# Altium schematic sheet SendClient_Sheet.schdoc
size 233 x 232 mm
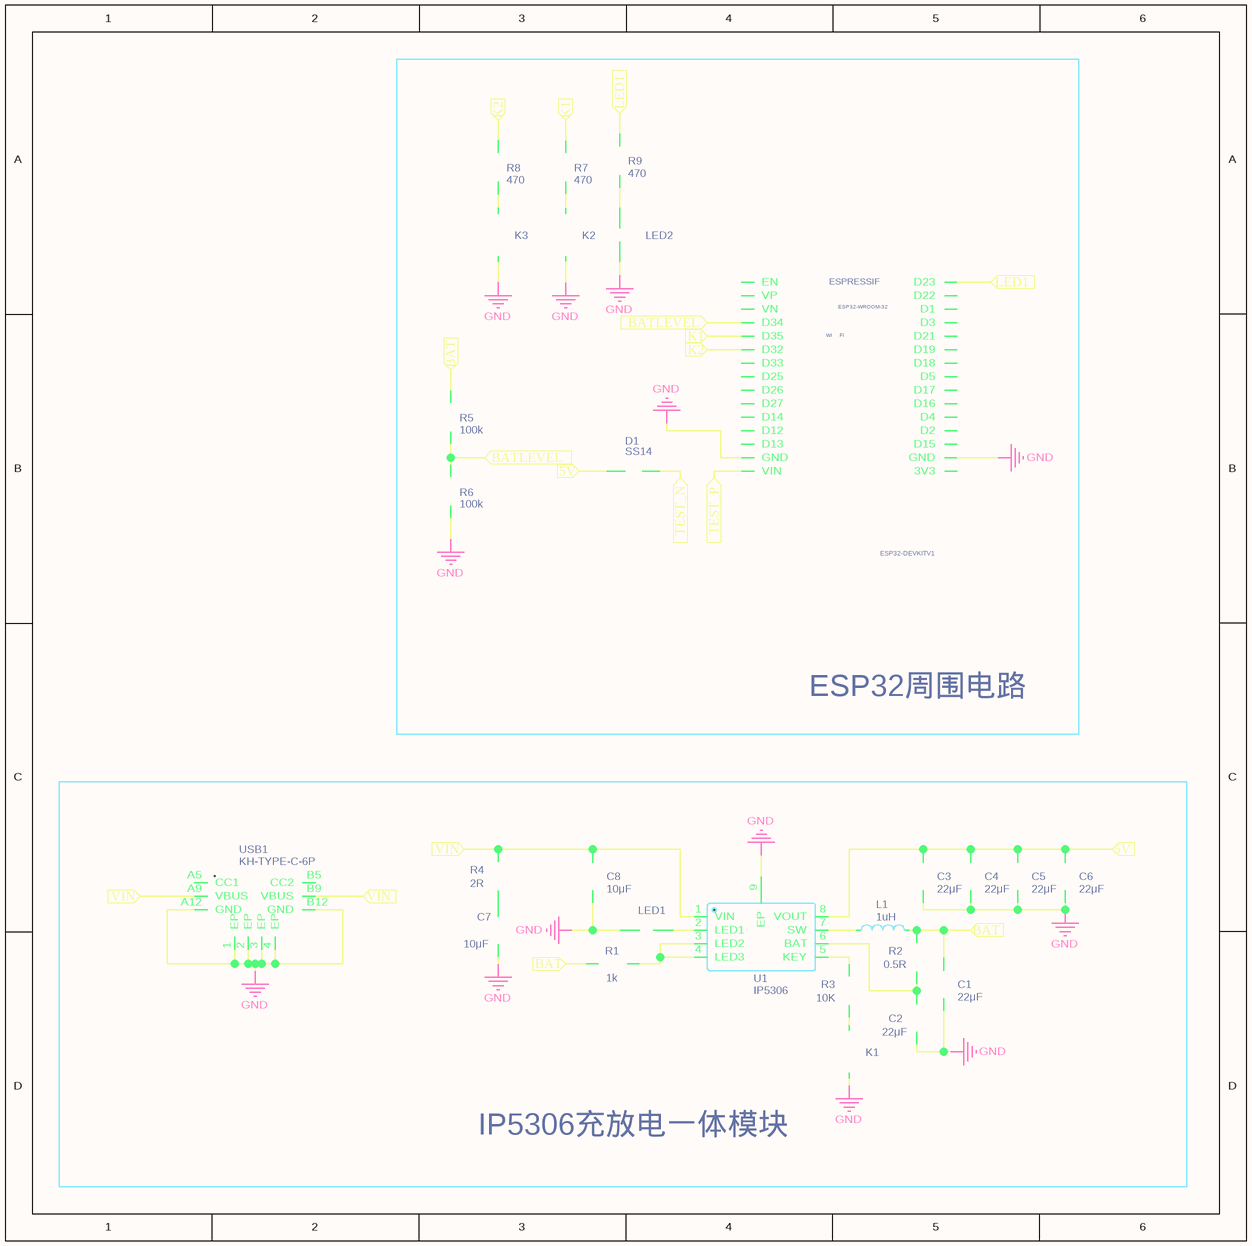
[diagram p0: SendClient_Sheet.schdoc]

## Parts
BOARD1  ESP32DEVKITV1  [ESP32-DEVKITV1]  (value not drawn)
C1  22μF  [C0603]
C2  22μF  [C0603]
C3  22μF  [C0603]
C4  22μF  [C0603]
C5  22μF  [C0603]
C6  22μF  [C0603]
C7  10μF  [C0603]
C8  10μF  [C0603]
D1  SS14  [SMA_L4.4-W2.8-LS5.4-RD]
K1  BUTTON_FLASH  [SMT_SW_PTS_820]  (value not drawn)
K2  BUTTON_FLASH  [SMT_SW_PTS_820]  (value not drawn)
K3  BUTTON_FLASH  [SMT_SW_PTS_820]  (value not drawn)
L1  1uH  [IND-SMD_L7.1-W6.6]
LED1  LED-0603_R  [LED0603_RED]  (value not drawn)
LED2  LED-0603_R  [LED0603_RED]  (value not drawn)
R1  1k  [R0603]
R2  0.5R  [R0603]
R3  10K  [R0603]
R4  2R  [R0603]
R5  100k  [R0603]
R6  100k  [R0603]
R7  470  [R0603]
R8  470  [R0603]
R9  470  [R0603]
U1  IP5306  [ESOP-8_L4.9-W3.9-P1.27-LS6.0-BL-EP]
USB1  KH-TYPE-C-6P  [TYPE-C-SMD_TYPE-C-31-M-16]

## Blocks framed on the sheet
ESP32周围电路: BOARD1 D1 K2 K3 LED2 R5-R9
IP5306充放电一体模块: C1-C8 K1 L1 LED1 R1-R4 U1 USB1

## Ports
5V (in), BAT (in), BATLEVEL (in), K1 (in), K2 (in), LED1 (in), TEST_N (in), TEST_P (in), VIN (in)

## Nets
GND: BOARD1.GND BOARD1.GND@1(GND) C1.1 C2.1 C3.1 C4.1 C5.1 C6.1 C7.1 C8.1 K1.2 K2.2 K3.2 LED1.2 LED2.2 R6.2 U1.9(EP) USB1.1(EP) USB1.2(EP) USB1.3(EP) USB1.4(EP) USB1.A12(GND) USB1.B12(GND)
5V: C3.2 C4.2 C5.2 C6.2 D1.2(A) U1.8(VOUT) ; port 5V
BAT: C1.2 L1.2 R1.2 R2.1 R5.1 ; port BAT
BATLEVEL: BOARD1.D34 R5.2 R6.1 ; port BATLEVEL
K1: BOARD1.D35 R7.2 ; port K1
K2: BOARD1.D32 R8.2 ; port K2
LED1: BOARD1.D23 R9.2 ; port LED1
TEST_N: D1.1(K) ; port TEST_N
TEST_P: BOARD1.VIN ; port TEST_P
VIN: C8.2 R4.1 U1.1(VIN) USB1.A9(VBUS) USB1.B9(VBUS) ; port VIN
NetC2_2: C2.2 R2.2 U1.6(BAT)
NetC7_2: C7.2 R4.2
NetK1_1: K1.1 R3.2
NetK2_1: K2.1 R7.1
NetK3_1: K3.1 R8.1
NetL1_1: L1.1 U1.7(SW)
NetLED1_1: LED1.1 U1.2(LED1)
NetLED2_1: LED2.1 R9.1
NetR1_1: R1.1 U1.3(LED2) U1.4(LED3)
NetR3_1: R3.1 U1.5(KEY)

Not connected (* = marked no-connect by the designer): BOARD1 3V3 D1 D2 D3 D4 D5 D12 D13 D14 D15 D16 D17 D18 D19 D21 D22 D25 D26 D27 D33 EN VN VP; USB1 A5(CC1) B5(CC2)

## Notes on the sheet
- (in symbol ESP32DEVKITV1) ESPRESSIF; ESP32-WROOM-32; WI; FI; ESP32-DEVKITV1

## Library data of the parts
BOARD1 = ESP32DEVKITV1: Contributor: radio; Package Display: No; spicePre: B; spiceSymbolName: ESP32DEVKITV1
C1-C6 = 22μF: BOM_Manufacturer: Walsin Tech Corp; BOM_Manufacturer Part: 0603B101K500CT; nameAlias: Capacitance; Contributor: LCSC; BOM_Supplier: LCSC; BOM_Supplier Part: C338150; BOM_JLCPCB Part Class: Extended Part; spicePre: C; spiceSymbolName: 0603B101K500CT
C7 C8 = 10μF: BOM_Manufacturer: Walsin Tech Corp; BOM_Manufacturer Part: 0603B101K500CT; nameAlias: Capacitance; Contributor: LCSC; BOM_Supplier: LCSC; BOM_Supplier Part: C338150; BOM_JLCPCB Part Class: Extended Part; spicePre: C; spiceSymbolName: 0603B101K500CT
D1 = SS14: BOM_Manufacturer: MDD; BOM_Supplier: LCSC; BOM_Manufacturer Part: SS14; BOM_Supplier Part: C2480; BOM_JLCPCB Part Class: Basic Part; spicePre: D; spiceSymbolName: SS14
K1-K3 = BUTTON_FLASH: Contributor: dingding1; spicePre: S; spiceSymbolName: SMT_SW_PTS_820
L1 = 1uH: BOM_Manufacturer: PROD(谱罗德); BOM_Manufacturer Part: PSPMAA0603-1R0M-ANF; nameAlias: Inductance; Contributor: LCSC; BOM_Supplier: LCSC; BOM_Supplier Part: C436543; BOM_JLCPCB Part Class: Extended Part; spicePre: L; spiceSymbolName: PSPMAA0603-1R0M-ANF
LED1 LED2 = LED-0603_R: BOM_Manufacturer: EVERLIGHT(台湾亿光); BOM_Manufacturer Part: 19-217/R6C-AL1M2VY/3T; Contributor: LCEDA_01; BOM_Supplier Part: C72044; BOM_Supplier: LCSC; spicePre: L; spiceSymbolName: LED-0603_R
R1 = 1k: BOM_Manufacturer: YAGEO; BOM_Manufacturer Part: RC0603JR-079K1L; nameAlias: Resistance (Ohms); BOM_Supplier: LCSC; BOM_Supplier Part: C137602; BOM_JLCPCB Part Class: Extended Part; spicePre: R; spiceSymbolName: RC0603JR-079K1L
R2 = 0.5R: BOM_Manufacturer: YAGEO; BOM_Manufacturer Part: RC0603JR-079K1L; nameAlias: Resistance (Ohms); BOM_Supplier: LCSC; BOM_Supplier Part: C137602; BOM_JLCPCB Part Class: Extended Part; spicePre: R; spiceSymbolName: RC0603JR-079K1L
R3 = 10K: BOM_Manufacturer: YAGEO; BOM_Manufacturer Part: RC0603JR-079K1L; nameAlias: Resistance (Ohms); BOM_Supplier: LCSC; BOM_Supplier Part: C137602; BOM_JLCPCB Part Class: Extended Part; spicePre: R; spiceSymbolName: RC0603JR-079K1L
R4 = 2R: BOM_Manufacturer: YAGEO; BOM_Manufacturer Part: RC0603JR-079K1L; nameAlias: Resistance (Ohms); BOM_Supplier: LCSC; BOM_Supplier Part: C137602; BOM_JLCPCB Part Class: Extended Part; spicePre: R; spiceSymbolName: RC0603JR-079K1L
R5 R6 = 100k: BOM_Manufacturer: YAGEO; BOM_Manufacturer Part: RC0603JR-079K1L; nameAlias: Resistance (Ohms); BOM_Supplier: LCSC; BOM_Supplier Part: C137602; BOM_JLCPCB Part Class: Extended Part; spicePre: R; spiceSymbolName: RC0603JR-079K1L
R7-R9 = 470: BOM_Manufacturer: YAGEO; BOM_Manufacturer Part: RC0603JR-079K1L; nameAlias: Resistance (Ohms); BOM_Supplier: LCSC; BOM_Supplier Part: C137602; BOM_JLCPCB Part Class: Extended Part; spicePre: R; spiceSymbolName: RC0603JR-079K1L
U1 = IP5306: BOM_Manufacturer: INJOINIC; Contributor: LCSC; BOM_Supplier: LCSC; BOM_Supplier Part: C181692; BOM_Manufacturer Part: IP5306; BOM_JLCPCB Part Class: Extended Part; spicePre: U; spiceSymbolName: IP5306
USB1 = KH-TYPE-C-6P: BOM_Manufacturer: Shenzhen Kinghelm Elec; Contributor: LCSC; BOM_Supplier: LCSC; BOM_Supplier Part: C709355; BOM_Manufacturer Part: KH-TYPE-C-6P; BOM_JLCPCB Part Class: Extended Part; spicePre: U; spiceSymbolName: KH-TYPE-C-6P